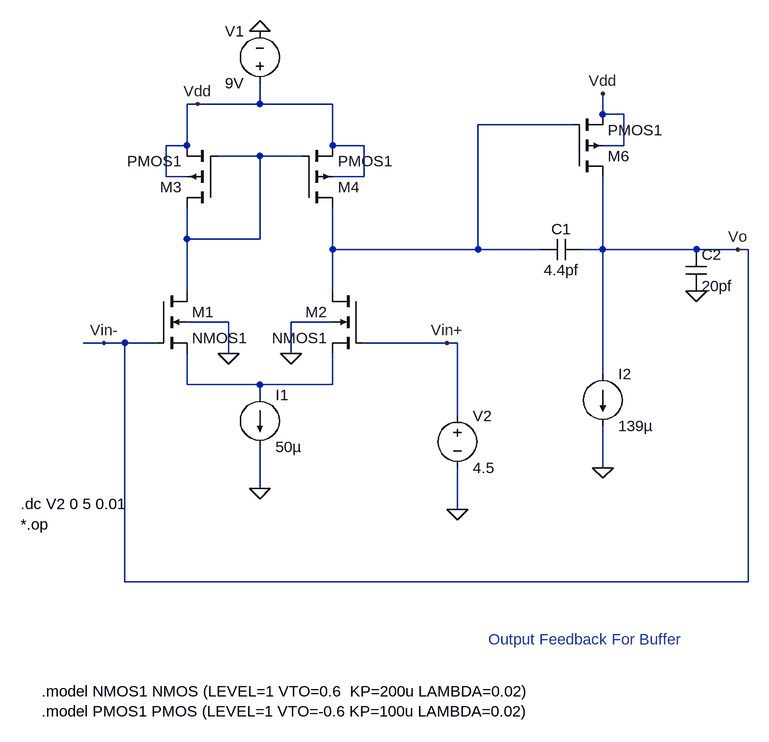
[diagram p0: schematic MOSFET_Op_amp_Isrc.asc]
MOSFET_Op_amp_Isrc.asc, the LTspice schematic file:
Version 4.1
SHEET 1 1028 1476
WIRE 144 -16 128 -16
WIRE 240 -16 240 -48
WIRE 240 -16 144 -16
WIRE 352 -16 240 -16
WIRE 768 0 768 -32
WIRE 800 0 768 0
WIRE 720 16 576 16
WIRE 128 48 128 -16
WIRE 128 48 96 48
WIRE 352 48 352 -16
WIRE 400 48 352 48
WIRE 800 48 800 0
WIRE 800 48 768 48
WIRE 240 64 176 64
WIRE 304 64 240 64
WIRE 96 96 96 48
WIRE 128 96 96 96
WIRE 400 96 400 48
WIRE 400 96 352 96
WIRE 128 192 128 144
WIRE 240 192 240 64
WIRE 240 192 128 192
WIRE 352 208 352 144
WIRE 576 208 576 16
WIRE 576 208 352 208
WIRE 672 208 576 208
WIRE 768 208 768 96
WIRE 768 208 736 208
WIRE 912 208 768 208
WIRE 976 208 912 208
WIRE 992 208 976 208
WIRE 128 272 128 192
WIRE 352 272 352 208
WIRE 192 320 128 320
WIRE 352 320 288 320
WIRE 0 352 -32 352
WIRE 32 352 0 352
WIRE 80 352 32 352
WIRE 528 352 400 352
WIRE 544 352 528 352
WIRE 192 368 192 320
WIRE 288 368 288 320
WIRE 768 400 768 208
WIRE 128 416 128 368
WIRE 240 416 128 416
WIRE 352 416 352 368
WIRE 352 416 240 416
WIRE 240 432 240 416
WIRE 544 464 544 352
WIRE 768 544 768 480
WIRE 240 576 240 512
WIRE 544 608 544 544
WIRE 32 720 32 352
WIRE 992 720 992 208
WIRE 992 720 32 720
FLAG 240 576 0
FLAG 240 -128 0
FLAG 192 368 0
FLAG 288 368 0
FLAG 768 -32 Vdd
FLAG 768 544 0
FLAG 976 208 Vo
FLAG 544 608 0
FLAG 912 272 0
FLAG 144 -16 Vdd
FLAG 528 352 Vin+
FLAG 0 352 Vin-
DATAFLAG 832 208 ""
DATAFLAG 592 16 ""
DATAFLAG 848 208 ""
DATAFLAG 768 272 ""
DATAFLAG 992 544 ""
DATAFLAG 992 544 ""
DATAFLAG 992 544 ""
DATAFLAG 992 544 ""
DATAFLAG 992 544 ""
DATAFLAG 992 544 ""
DATAFLAG 992 544 ""
DATAFLAG 992 544 ""
DATAFLAG 992 544 ""
SYMBOL nmos4 80 272 R0
SYMATTR InstName M1
SYMATTR Value NMOS1
SYMATTR Value2 l=300n w=300n
SYMBOL nmos4 400 272 M0
SYMATTR InstName M2
SYMATTR Value NMOS1
SYMATTR Value2 l=300n w=300n
SYMBOL current 240 432 R0
WINDOW 123 0 0 Left 0
WINDOW 39 0 0 Left 0
SYMATTR InstName I1
SYMATTR Value 50µ
SYMBOL voltage 240 -32 R180
WINDOW 0 24 96 Left 2
WINDOW 3 24 16 Left 2
WINDOW 123 0 0 Left 0
WINDOW 39 0 0 Left 0
SYMATTR InstName V1
SYMATTR Value 9V
SYMBOL voltage 544 448 R0
WINDOW 123 0 0 Left 0
WINDOW 39 0 0 Left 0
SYMATTR InstName V2
SYMATTR Value 4.5
SYMBOL cap 736 192 R90
WINDOW 0 0 32 VBottom 2
WINDOW 3 32 32 VTop 2
SYMATTR InstName C1
SYMATTR Value 4.4pf
SYMBOL current 768 400 R0
WINDOW 123 0 0 Left 0
WINDOW 39 0 0 Left 0
SYMATTR InstName I2
SYMATTR Value 139µ
SYMBOL pmos4 176 144 R180
SYMATTR InstName M3
SYMATTR Value PMOS1
SYMATTR Value2 l=300n w=600n
SYMBOL pmos4 304 144 M180
SYMATTR InstName M4
SYMATTR Value PMOS1
SYMATTR Value2 l=300n w=600n
SYMBOL pmos4 720 96 M180
SYMATTR InstName M6
SYMATTR Value PMOS1
SYMATTR Value2 l=300n w=3300n
SYMBOL cap 896 208 R0
SYMATTR InstName C2
SYMATTR Value 20pf
TEXT -128 600 Left 2 !.dc V2 0 5 0.01\n*.op
TEXT 592 808 Left 2 ;Output Feedback For Buffer
TEXT -96 888 Left 2 !.model NMOS1 NMOS (LEVEL=1 VTO=0.6  KP=200u LAMBDA=0.02)\n.model PMOS1 PMOS (LEVEL=1 VTO=-0.6 KP=100u LAMBDA=0.02)

The netlist it stands for:
* MOSFET_Op_amp_Isrc.asc
M1 N002 Vin- N003 0 NMOS1 l=300n w=300n
M2 N001 Vin+ N003 0 NMOS1 l=300n w=300n
I1 N003 0 50µ
V1 Vdd 0 9V
V2 Vin+ 0 4.5
C1 Vin- N001 4.4pf
I2 Vin- 0 139µ
M3 N002 N002 Vdd Vdd PMOS1 l=300n w=600n
M4 N001 N002 Vdd Vdd PMOS1 l=300n w=600n
M6 Vin- N001 Vdd Vdd PMOS1 l=300n w=3300n
C2 Vin- 0 20pf
.model NMOS NMOS
.model PMOS PMOS
.lib standard.mos
.dc V2 0 5 0.01
*.op
* Output Feedback For Buffer
.model NMOS1 NMOS (LEVEL=1 VTO=0.6  KP=200u LAMBDA=0.02)
.model PMOS1 PMOS (LEVEL=1 VTO=-0.6 KP=100u LAMBDA=0.02)
.backanno
.end